# EAGLE schematic 6502__R8_EXP1 (EAGLE 7.5.0)
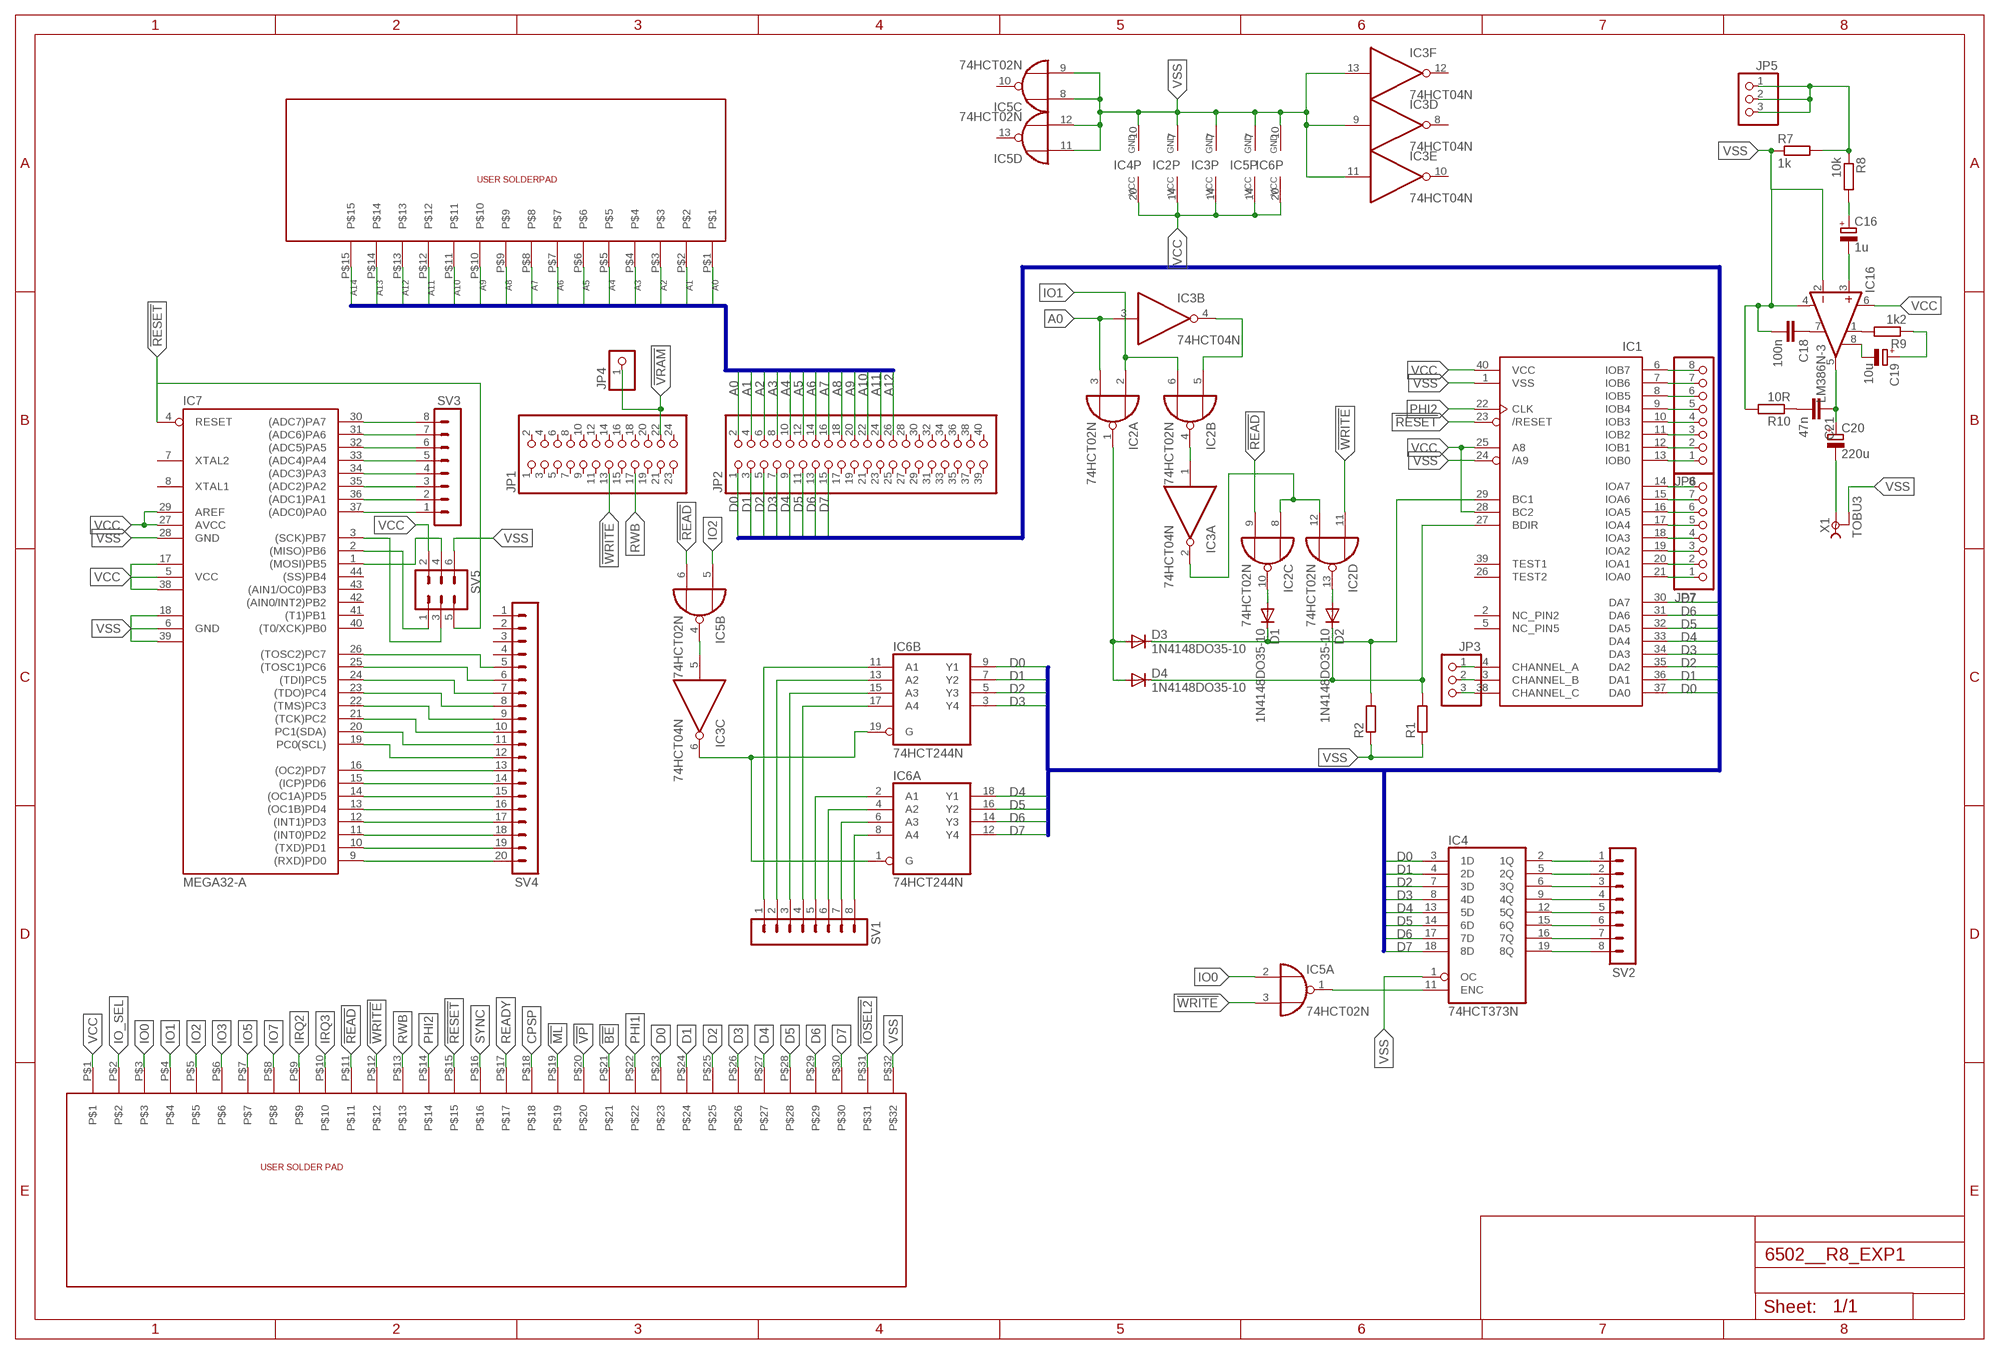
[diagram p0: schematic, sheet 1]

## Parts
C16  1u  CPOL-EUE5-5  [E5-5]
C18  100n  C-EU025-030X050  [C025-030X050]
C19  10u  CPOL-EUE5-5  [E5-5]
C20  220u  CPOL-EUE5-5  [E5-5]
C21  47n  C-EU025-030X050  [C025-030X050]
D1  1N4148DO35-10  [DO35-10]
D2  1N4148DO35-10  [DO35-10]
D3  1N4148DO35-10  [DO35-10]
D4  1N4148DO35-10  [DO35-10]
IC1  AY-3-8910  [DIL40]
IC2  74HCT02N  [DIL14]
IC3  74HCT04N  [DIL14]
IC4  74HCT373N  [DIL20]
IC5  74HCT02N  [DIL14]
IC6  74HCT244N  [DIL20]
IC7  MEGA32-A  [TQFP44]
IC16  LM386N-3  [DIL08]
JP1  PINHD-2X12  [2X12]
JP2  PINHD-2X20  [2X20]
JP3  PINHD-1X3  [1X03]
JP4  PINHD-1X1  [1X01]
JP5  PINHD-1X3  [1X03]
JP6  PINHD-1X8  [1X08]
JP7  PINHD-1X8  [1X08]
R1  R-EU_0204/7  [0204/7]
R2  R-EU_0204/7  [0204/7]
R7  1k  R-EU_0207/12  [0207/12]
R8  10k  R-EU_0207/12  [0207/12]
R9  1k2  R-EU_0207/12  [0207/12]
R10  10R  R-EU_0207/12  [0207/12]
SV1  MA08-1  [MA08-1]
SV2  MA08-1  [MA08-1]
SV3  MA08-1  [MA08-1]
SV4  MA20-1  [MA20-1]
SV5  MA03-2  [MA03-2]
U$2  SOLDERPAD  [SOLDERPAD]
U$3  SOLDERPAD2  [SOLDERPAD2]
X1  TOBU3  [TOBU3]

## Nets
!BE: U$2.P$21
!IOSEL2: U$2.P$31
!ML: U$2.P$19
!READ: IC2.9(C:I1) IC5.6(B:I1) U$2.P$11
!RESET: IC1.23(/RESET) IC7.4(RESET) SV5.5 U$2.P$15
!VP: U$2.P$20
!VRAM: JP1.22 JP4.1
!WRITE: IC2.11(D:I0) IC5.3(A:I1) JP1.13 U$2.P$12
A0: IC2.3(A:I1) IC3.3(B:I) JP2.2 U$3.P$1
A1: JP2.4 U$3.P$2
A2: JP2.6 U$3.P$3
A3: JP2.8 U$3.P$4
A4: JP2.10 U$3.P$5
A5: JP2.12 U$3.P$6
A6: JP2.14 U$3.P$7
A7: JP2.16 U$3.P$8
A8: JP2.18 U$3.P$9
A9: JP2.20 U$3.P$10
A10: JP2.22 U$3.P$11
A11: JP2.24 U$3.P$12
A12: JP2.26 U$3.P$13
A13: U$3.P$14
A14: U$3.P$15
CPSP: U$2.P$18
D0: IC1.37(DA0) IC4.3(1D) IC6.9(B:Y1) JP2.1 U$2.P$23
D1: IC1.36(DA1) IC4.4(2D) IC6.7(B:Y2) JP2.3 U$2.P$24
D2: IC1.35(DA2) IC4.7(3D) IC6.5(B:Y3) JP2.5 U$2.P$25
D3: IC1.34(DA3) IC4.8(4D) IC6.3(B:Y4) JP2.7 U$2.P$26
D4: IC1.33(DA4) IC4.13(5D) IC6.18(A:Y1) JP2.9 U$2.P$27
D5: IC1.32(DA5) IC4.14(6D) IC6.16(A:Y2) JP2.11 U$2.P$28
D6: IC1.31(DA6) IC4.17(7D) IC6.14(A:Y3) JP2.13 U$2.P$29
D7: IC1.30(DA7) IC4.18(8D) IC6.12(A:Y4) JP2.15 U$2.P$30
IO0: IC5.2(A:I0) U$2.P$3
IO1: IC2.2(A:I0) IC2.6(B:I1) U$2.P$4
IO2: IC5.5(B:I0) U$2.P$5
IO3: U$2.P$6
IO5: U$2.P$7
IO7: U$2.P$8
IO_SEL: U$2.P$2
IRQ2: U$2.P$9
IRQ3: U$2.P$10
N$1: IC4.11(ENC) IC5.1(A:O)
N$2: IC6.11(B:A1) SV1.1
N$3: IC2.5(B:I0) IC3.4(B:O)
N$4: IC2.4(B:O) IC3.1(A:I)
N$5: IC2.8(C:I0) IC2.12(D:I1) IC3.2(A:O)
N$6: IC6.13(B:A2) SV1.2
N$7: D3.A D4.A IC2.1(A:O)
N$8: D1.C D3.C IC1.29(BC1) R2.2
N$9: D2.C D4.C IC1.27(BDIR) R1.2
N$10: D1.A IC2.10(C:O)
N$11: D2.A IC2.13(D:O)
N$12: IC6.15(B:A3) SV1.3
N$13: IC6.17(B:A4) SV1.4
N$14: IC6.2(A:A1) SV1.5
N$15: IC6.4(A:A2) SV1.6
N$16: IC6.6(A:A3) SV1.7
N$17: IC6.8(A:A4) SV1.8
N$18: IC3.5(C:I) IC5.4(B:O)
N$19: IC3.6(C:O) IC6.1(A:G) IC6.19(B:G)
N$20: IC4.2(1Q) SV2.1
N$21: IC4.5(2Q) SV2.2
N$22: IC4.6(3Q) SV2.3
N$23: IC4.9(4Q) SV2.4
N$24: IC4.12(5Q) SV2.5
N$25: IC4.15(6Q) SV2.6
N$26: IC4.16(7Q) SV2.7
N$27: IC4.19(8Q) SV2.8
N$28: IC1.4(CHANNEL_A) JP3.1
N$29: IC1.3(CHANNEL_B) JP3.2
N$30: IC1.38(CHANNEL_C) JP3.3
N$31: IC1.13(IOB0) JP6.1
N$32: IC7.37((ADC0)PA0) SV3.1
N$33: IC7.36((ADC1)PA1) SV3.2
N$34: IC7.35((ADC2)PA2) SV3.3
N$35: IC7.9((RXD)PD0) SV4.20
N$36: IC7.10((TXD)PD1) SV4.19
N$37: IC7.11((INT0)PD2) SV4.18
N$38: IC7.12((INT1)PD3) SV4.17
N$39: IC7.13((OC1B)PD4) SV4.16
N$40: IC7.14((OC1A)PD5) SV4.15
N$41: IC7.15((ICP)PD6) SV4.14
N$42: IC7.16((OC2)PD7) SV4.13
N$43: IC7.19(PC0(SCL)) SV4.12
N$44: IC7.20(PC1(SDA)) SV4.11
N$45: IC7.21((TCK)PC2) SV4.10
N$46: IC7.22((TMS)PC3) SV4.9
N$47: IC7.23((TDO)PC4) SV4.8
N$48: IC7.24((TDI)PC5) SV4.7
N$49: IC7.25((TOSC1)PC6) SV4.6
N$50: IC7.26((TOSC2)PC7) SV4.5
N$51: IC7.2((MISO)PB6) SV5.1
N$52: IC7.3((SCK)PB7) SV5.3
N$53: IC7.34((ADC3)PA3) SV3.4
N$54: IC7.1((MOSI)PB5) SV5.4
N$55: IC7.33((ADC4)PA4) SV3.5
N$56: IC7.32((ADC5)PA5) SV3.6
N$57: IC7.31((ADC6)PA6) SV3.7
N$58: IC7.30((ADC7)PA7) SV3.8
N$59: IC1.12(IOB1) JP6.2
N$60: IC1.11(IOB2) JP6.3
N$61: IC1.10(IOB3) JP6.4
N$62: IC1.9(IOB4) JP6.5
N$63: IC1.8(IOB5) JP6.6
N$64: IC1.7(IOB6) JP6.7
N$65: IC1.6(IOB7) JP6.8
N$66: IC1.21(IOA0) JP7.1
N$67: IC1.20(IOA1) JP7.2
N$68: IC1.19(IOA2) JP7.3
N$69: IC1.18(IOA3) JP7.4
N$70: IC1.17(IOA4) JP7.5
N$71: IC1.16(IOA5) JP7.6
N$72: IC1.15(IOA6) JP7.7
N$73: IC1.14(IOA7) JP7.8
N$114: JP5.1 JP5.2 JP5.3 R7.2 R8.1
N$115: C16.+ R8.2
N$116: C16.- IC16.3(+IN)
N$117: C18.1 IC16.7(BYPASS)
N$126: C19.- IC16.8(GAIN)
N$127: IC16.1(GAIN) R9.2
N$128: C19.+ R9.1
N$129: C20.- X1.1
N$130: C20.+ C21.1 IC16.5(OUT)
N$133: C21.2 R10.1
PHI1: U$2.P$22
PHI2: IC1.22(CLK) U$2.P$14
READY: U$2.P$17
RWB: JP1.17 U$2.P$13
SYNC: U$2.P$16
VCC [Power]: IC1.25(A8) IC1.28(BC2) IC1.40(VCC) IC2.14(P:VCC) IC3.14(P:VCC) IC4.20(VCC) IC5.14(P:VCC) IC6.20(P:VCC) IC7.5(VCC) IC7.17(VCC1) IC7.27(AVCC) IC7.29(AREF) IC7.38(VCC2) IC16.6(VS) SV5.2 U$2.P$1
VSS [Power]: C18.2 IC1.1(VSS) IC1.24(/A9) IC2.7(P:GND) IC3.7(P:GND) IC3.9(D:I) IC3.11(E:I) IC3.13(F:I) IC4.1(OC) IC4.10(GND) IC5.7(P:GND) IC5.8(C:I0) IC5.9(C:I1) IC5.11(D:I0) IC5.12(D:I1) IC6.10(P:GND) IC7.6(GND) IC7.18(GND1) IC7.28(GND) IC7.39(GND2) IC16.2(-IN) IC16.4(GND) R1.1 R2.1 R7.1 R10.2 SV5.6 U$2.P$32 X1.2 X1.2@1 X1.2@2
Unconnected: IC1.2(NC_PIN2) IC1.5(NC_PIN5) IC1.26(TEST2) IC1.39(TEST1) IC3.8(D:O) IC3.10(E:O) IC3.12(F:O) IC5.10(C:O) IC5.13(D:O) IC7.7(XTAL2) IC7.8(XTAL1) IC7.40((T0/XCK)PB0) IC7.41((T1)PB1) IC7.42((AIN0/INT2)PB2) IC7.43((AIN1/OC0)PB3) IC7.44((SS)PB4) JP1.1 JP1.2 JP1.3 JP1.4 JP1.5 JP1.6 JP1.7 JP1.8 JP1.9 JP1.10 JP1.11 JP1.12 JP1.14 JP1.15 JP1.16 JP1.18 JP1.19 JP1.20 JP1.21 JP1.23 JP1.24 JP2.17 JP2.19 JP2.21 JP2.23 JP2.25 JP2.27 JP2.28 JP2.29 JP2.30 JP2.31 JP2.32 JP2.33 JP2.34 JP2.35 JP2.36 JP2.37 JP2.38 JP2.39 JP2.40 SV4.1 SV4.2 SV4.3 SV4.4

## Buses
D[0..7]
A[0..15]

## Library data of the parts
C16 C19 C20 = rcl:CPOL-EU: POLARIZED CAPACITOR, European symbol
C18 C21 = rcl:C-EU: CAPACITOR, European symbol
D1-D4 = diode:1N4148: DIODE high speed (Philips)
IC1 = 8Bit_Parts:AY-3-8910
IC2 IC5 = 74xx-eu:74*02: Quad 2-input NOR gate
IC3 = 74xx-eu:74*04: Hex INVERTER
IC4 = 74xx-eu:74*373: Octal D type transparent LATCH, edge triggered
IC6 = 74xx-eu:74*244: Octal BUFFER and LINE DRIVER, 3-state
IC7 = atmel:MEGA32: MICROCONTROLLER 32 Kbytes FLASH 2 Kbytes SRAM 1 Kbytes EEPROM USART 8-channel 10 bit ADC Source: www.atmel.com .. doc2503.pdf; MPN: ATMEGA32-16AU; OC_FARNELL: 9171274; OC_NEWARK: 69K6677
IC16 = linear:LM386?-*: Low Voltage Audio Power Amplifier Source: http://cache.national.com/ds/LM/LM386.pdf
JP1 = pinhead:PINHD-2X12: PIN HEADER
JP2 = pinhead:PINHD-2X20: PIN HEADER
JP3 JP5 = pinhead:PINHD-1X3: PIN HEADER
JP4 = pinhead:PINHD-1X1: PIN HEADER
JP6 JP7 = pinhead:PINHD-1X8: PIN HEADER
R1 R2 R7-R10 = rcl:R-EU_: RESISTOR, European symbol
SV1-SV3 = con-lstb:MA08-1: PIN HEADER; OC_FARNELL: unknown; OC_NEWARK: unknown
SV4 = con-lstb:MA20-1: PIN HEADER; OC_FARNELL: unknown; OC_NEWARK: unknown
SV5 = con-lstb:MA03-2: PIN HEADER; OC_FARNELL: unknown; OC_NEWARK: unknown
U$2 = logik2:SOLDERPAD
U$3 = logik:SOLDERPAD2
X1 = logik2:TOBU3: Female Cinch CONNECTOR ( RCA Jack ); MF: FARNELL; MPN: TOBU 3; OC_FARNELL: 592791; OC_NEWARK: 06WX5914

## Net classes
1 Power: width 0.508 mm, drill 0.508 mm, clearance 0.152 mm